# EAGLE design WeMos32Buttons (EAGLE 8.7.0)
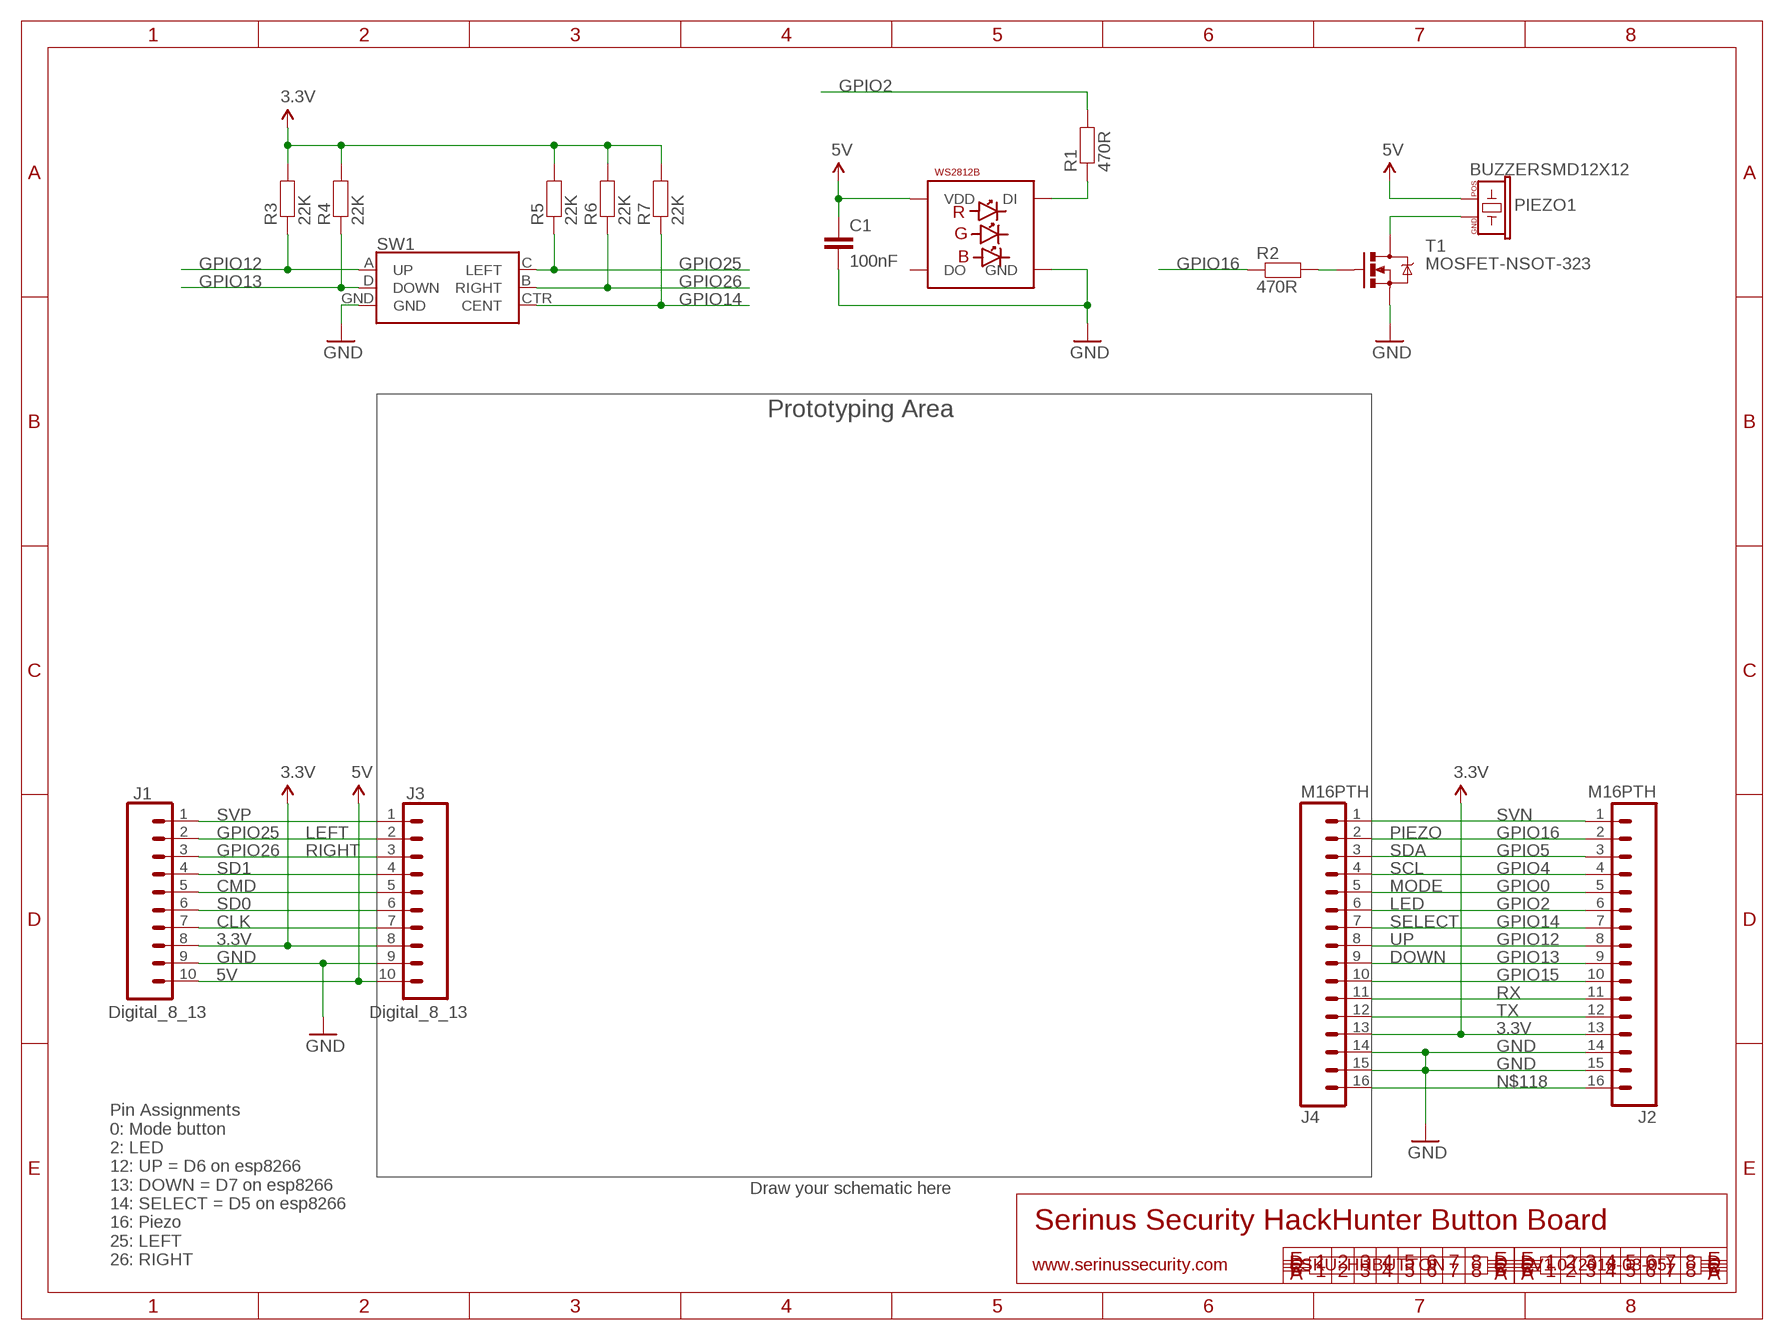
[diagram p0: schematic, sheet 1]

## Parts
C1  100nF  CAP0603  [0603]
J1  Digital_8_13  M100.1  [1X10]
J2  M16PTH  [1X16]
J3  Digital_8_13  M100.1  [1X10]
J4  M16PTH  [1X16]
LED2  WS2812B5050  [WS2812B]
PIEZO1  BUZZERSMD12X12  [BUZZER-12X12-SMT]
R1  470R  RESISTOR0603  [0603]
R2  470R  RESISTOR0603  [0603]
R3  22K  RESISTOR0603  [0603]
R4  22K  RESISTOR0603  [0603]
R5  22K  RESISTOR0603  [0603]
R6  22K  RESISTOR0603  [0603]
R7  22K  RESISTOR0603  [0603]
SW1  JOYSTICK_MINI  [JOYSTICK_MINI]
T1  MOSFET-NSOT-323  [SOT32-3]

## Nets
3.3V: J1.8 J2.13 J3.8 J4.13 R3.2 R4.2 R5.2 R6.2 R7.2
5V: C1.1 J1.10 J3.10 LED2.1-VDD(VDD) PIEZO1.2(POS)
CLK: J1.7 J3.7
CMD: J1.5 J3.5
GND: C1.2 J1.9 J2.14 J2.15 J3.9 J4.14 J4.15 LED2.3-GND(GND) SW1.GND T1.2(S)
GPIO0: J2.5 J4.5
GPIO2: J2.6 J4.6 R1.2
GPIO4: J2.4 J4.4
GPIO5: J2.3 J4.3
GPIO12: J2.8 J4.8 R3.1 SW1.A(UP)
GPIO13: J2.9 J4.9 R4.1 SW1.D(DOWN)
GPIO14: J2.7 J4.7 R7.1 SW1.CTR(CENT)
GPIO15: J2.10 J4.10
GPIO16: J2.2 J4.2 R2.1
GPIO25: J1.2 J3.2 R5.1 SW1.C(LEFT)
GPIO26: J1.3 J3.3 R6.1 SW1.B(RIGHT)
N$8: PIEZO1.1(GND) T1.3(D)
N$9: R2.2 T1.1(G)
N$118: J2.16 J4.16
N$246: LED2.4-DIN(DI) R1.1
RX: J2.11 J4.11
SD0: J1.6 J3.6
SD1: J1.4 J3.4
SVN: J2.1 J4.1
SVP: J1.1 J3.1
TX: J2.12 J4.12
Unconnected: LED2.2-DOUT(DO)

## Notes on the sheet
- Prototyping Area
- LEFT | PIEZO
- RIGHT | SDA
- SCL
- MODE
- LED
- SELECT
- UP
- DOWN
- Draw your schematic here
- Serinus Security HackHunter Button Board
- Pin Assignments
  0: Mode button
  2: LED
  12: UP = D6 on esp8266
  13: DOWN = D7 on esp8266
  14: SELECT = D5 on esp8266
  16: Piezo
  25: LEFT
  26: RIGHT
- www.serinussecurity.com | SKU: HHBUTTON | V1.0 (2018-03-05)

## Library data of the parts
C1 = freetronics-jon:CAP: Capacitor Standard 0603 ceramic capacitor, and 0.1" leaded capacitor.
J1 J3 = freetronics-original:M10: Header 10 Standard 10-pin 0.1" header. Use with straight break away headers (SKU : PRT-00116), right angle break away headers (PRT-00553), swiss pins (PRT-00743), machine pins (PRT-00117), and female headers (PRT-00115).
J2 J4 = freetronics-jon:M16
LED2 = freetronics-jon:WS2812B
PIEZO1 = freetronics-master-v1.1:BUZZER: Buzzer - Piezo Transducer
R1-R7 = freetronics-jon:RESISTOR: Resistor Basic schematic elements and footprints for 0603, 1206, and PTH 1/10th watt (small) resistors.
SW1 = SparkFun-Switches:JOYSTICK_MINI: Small Tactile Joystick w/ Select Switch A 5-way tactile switch allows for a joystick-like interface in a very small package. Part #: 4UCON SF303GJ26 SparkFun Products 5-way Tactile Switch <https://www.sparkfun.com/products/10063> (COM-10063) Used on SparkFun Block for Intel® Edison - OLED <https://www.sparkfun.com/products/13035> (DEV-13035) Used on CAN-BUS Shield <https://www.sparkfun.com/products/13262> (DEV-13262); PROD_ID: SWCH-09905; SF_SKU: COM-10063
T1 = freetronics-jon:MOSFET-N: Basic N-Channel MOSFET

## Board
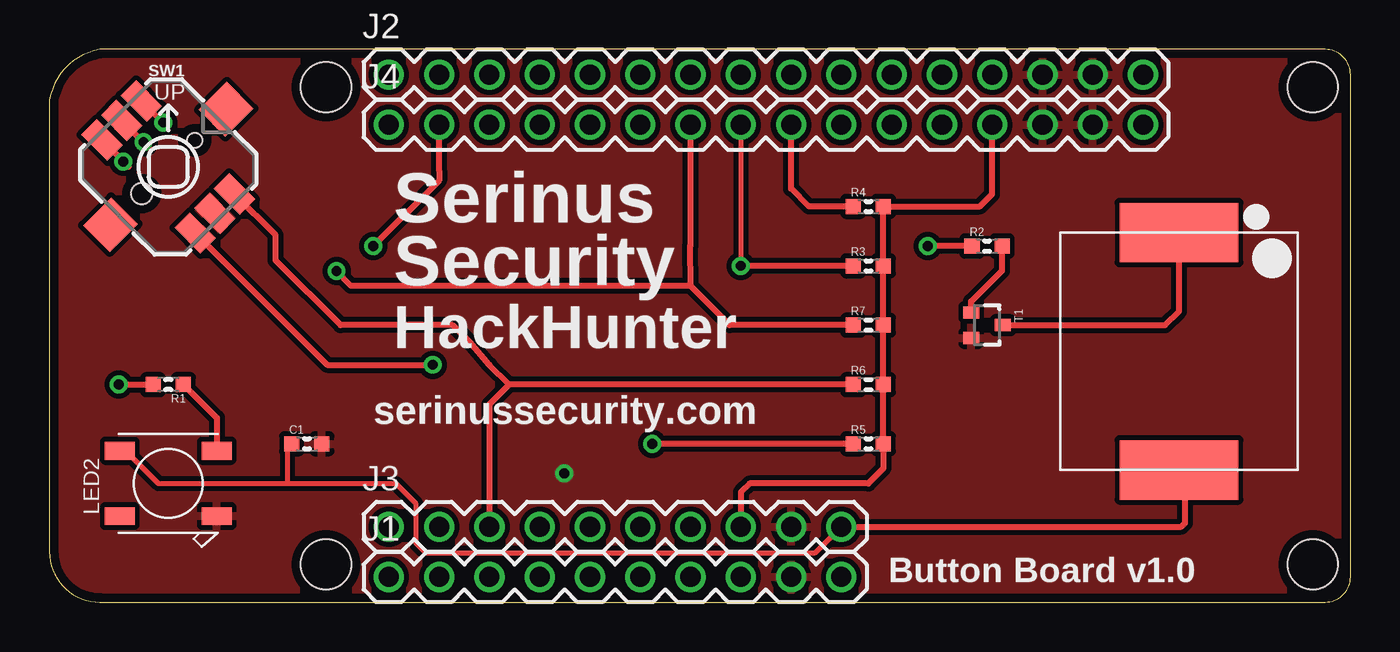
[diagram p1: board, top side]
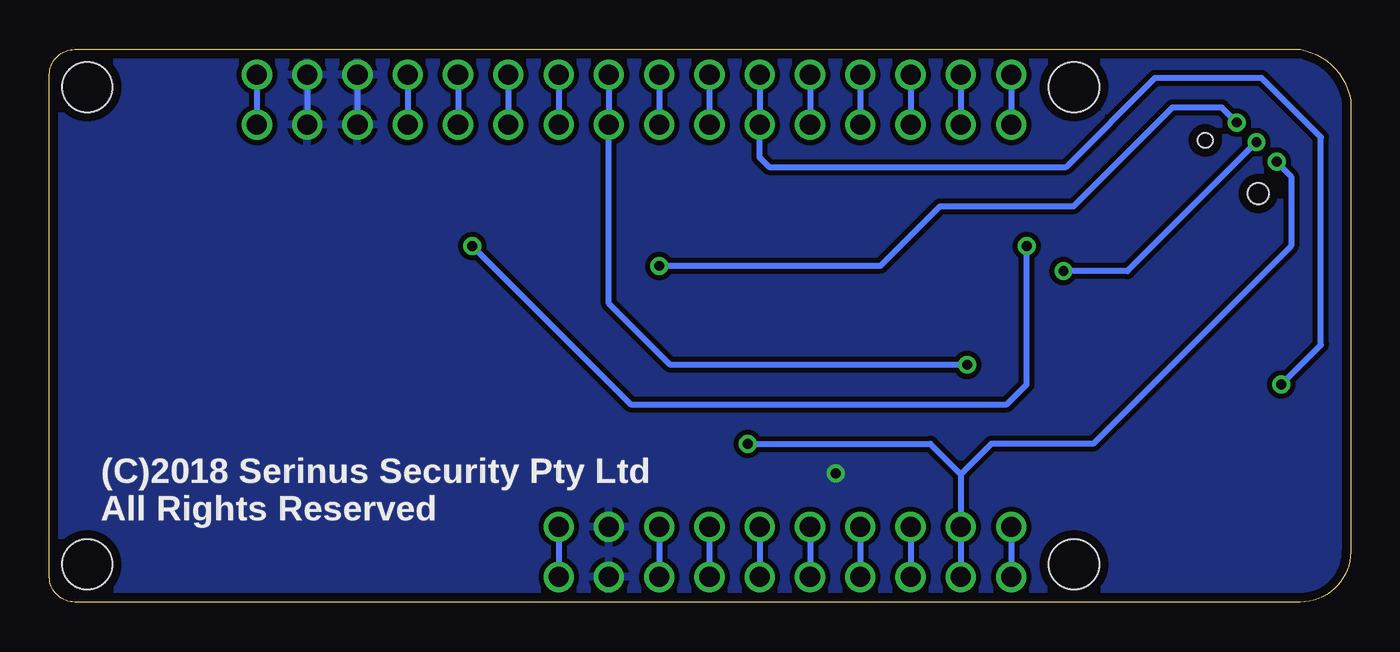
[diagram p2: board, bottom side, seen from below]

Size 65.72 x 27.94 mm. Coordinates in mm from the lower left corner, seen from the top.
Outline: 0,2.54 arc90 2.54,0 64.45,0 arc90 65.72,1.27 65.72,26.67 arc90 64.45,27.94 2.54,27.94 arc70 0,25.4 0,2.54
Copper layers (1*16): Top 0.035mm / dielectric 1.5mm / Bottom 0.035mm
Design rules "default *": minimum track width 10mil, minimum drill 24mil, track to track 10mil, track to pad 10mil, pad to pad 10mil, via to via 10mil, smd to smd 8mil, copper to edge 18mil, drill to drill 8mil, minimum pad ring 10mil, minimum via ring 8mil, stop-mask expansion 4mil, vias tented up to drill 0mil, thermal gap 10mil
Holes 2.54 mm at 13.97,26.04 13.97,1.91 63.82,1.91 63.82,26.04

### Footprints (pad centres in the part's own frame; a part is rotated, then mirrored left to right if it is on the bottom)
0603 = smd 0.762 x 0.762: 1 -0.762,0; 2 0.762,0
1X10 = drill 1.016: 1 0,0; 2 2.54,0; 3 5.08,0; 4 7.62,0; 5 10.16,0; 6 12.7,0; 7 15.24,0; 8 17.78,0; 9 20.32,0; 10 22.86,0
1X16 = drill 1.016: 1 0,0; 2 2.54,0; 3 5.08,0; 4 7.62,0; 5 10.16,0; 6 12.7,0; 7 15.24,0; 8 17.78,0; 9 20.32,0; 10 22.86,0; 11 25.4,0; 12 27.94,0; 13 30.48,0; 14 33.02,0; 15 35.56,0; 16 38.1,0
WS2812B = smd 1.5 x 0.9: 1-VDD 2.45,-1.65; 2-DOUT 2.45,1.65; 3-GND -2.45,1.65; 4-DIN -2.45,-1.65
BUZZER-12X12-SMT = smd 3 x 6: 1 -6,0; 2 6,0
JOYSTICK_MINI = smd 1.85 x 1.1: A -3.325,1.4; B 3.325,1.4; C -3.325,-1.4; CTR -3.325,0; D 3.325,-1.4; GND 3.325,0 | smd 1.9 x 2: NC 0,4.13; NC@0 0,-4.13 | hole 0.75: 0,1.9 | hole 1.05: 0,-1.9
SOT32-3 = smd 0.6 x 0.8: 1 -0.65,-0.8; 2 0.65,-0.8; 3 0,0.8

### Placement (x,y rotation side)
C1  13,8 0 top
J1  17.14,1.27 0 top
J2  17.14,26.67 0 top
J3  17.14,3.81 0 top
J4  17.14,24.13 0 top
LED2  6,6 180 top
PIEZO1  57.06,12.68 270 top
R1  6,11 180 top
R2  47.37,18 0 top
R3  41.37,17 0 top
R4  41.37,20 0 top
R5  41.37,8 0 top
R6  41.37,11 0 top
R7  41.37,14 0 top
SW1  6,22 315 top
T1  47.37,14 270 top

### Tracks (layer width: path | path; a pad name or v marks a point on that pad's centre or on a via)
3.3V
  Top 0.305: J3.8 34.92,5.56 35.37,6 41.37,6 42.13,6.76 R5.2 R6.2 R7.2 R3.2 R4.2 47,20 47.62,20.62 J4.13
  Bottom 0.305: J3.8 J1.8 | J2.13 J4.13
5V
  Top 0.254: LED2.1-VDD 3.85,7.65 5.5,6 12,6 | 12,6 17.5,6 18.5,5 18.5,3 19,2.5 38.7,2.5 J3.10 | C1.1 12,7.76 12,6
  Top 0.305: J3.10 57.17,3.81 57.37,4 57.37,6.98 | 57.37,7 57.37,6.98 | 57.37,6.98 PIEZO1.2
  Bottom 0.305: J3.10 J1.10
CLK
  Bottom 0.305: J3.7 J1.7
CMD
  Bottom 0.305: J3.5 J1.5
GND  (via drill 0.5)
  Bottom 0.305: J2.15 J4.15 | J2.14 J4.14
  other vias: 26,6.5
  pour Bottom: 0,25.4 arc-90 2.54,27.94 64.45,27.94 arc-90 65.72,26.67 65.72,1.27 arc-90 64.45,0 2.54,0 arc-90 0,2.54
  pour Top: 0,25.4 arc-90 2.54,27.94 64.45,27.94 arc-90 65.72,26.67 65.72,1.27 arc-90 64.45,0 2.54,0 arc-90 0,2.54
GPIO0
  Bottom 0.305: J2.5 J4.5
GPIO2  (via drill 0.5)
  Top 0.305: v3.5,11 R1.2
  Bottom 0.305: J2.6 J4.6 29.84,22.48 29.36,22 14.37,22 9.87,26.5 4.5,26.5 1.5,23.5 1.5,13 v3.5,11
GPIO4
  Bottom 0.305: J2.4 J4.4
GPIO5
  Bottom 0.305: J2.3 J4.3
GPIO12  (via drill 0.5)
  Top 0.254: J4.8 v34.92,17
  Top 0.305: R3.1 v34.92,17 | SW1.A 4.66,25.34 v5.75,24.25
  Bottom 0.305: J2.8 J4.8 | v34.92,17 23.75,17 20.75,20 14,20 9,25 6.5,25 v5.75,24.25
GPIO13  (via drill 0.5)
  Top 0.305: R4.1 38.37,20 37.47,20.9 J4.9 | SW1.D 14.02,12 v19.36,12
  Bottom 0.305: J2.9 J4.9 37.47,15.1 34.37,12 v19.36,12
GPIO14  (via drill 0.5)
  Top 0.305: R7.1 34.37,14 32.38,15.98 32.38,16 | 32.38,16 32.37,17.98 | 32.37,17.98 32.37,18 | 32.37,17.98 32.38,18 J4.7 | SW1.CTR 5,23 v4.75,23.25 | v14.5,16.73 15.23,16 32.38,16
  Bottom 0.305: J2.7 J4.7 | v4.75,23.25 11.27,16.73 v14.5,16.73
GPIO15
  Bottom 0.305: J2.10 J4.10
GPIO16  (via drill 0.5)
  Top 0.305: R2.1 v44.37,18 | J4.2 19.68,22 19.68,21.82 19.68,21.32 v16.36,18
  Bottom 0.305: J2.2 J4.2 | v44.37,18 36.37,10 17.36,10 16.36,11 v16.36,18
GPIO25  (via drill 0.5)
  Top 0.305: R5.1 v30.45,8 | SW1.C 4,22.02 4,22 v3.73,22.27
  Bottom 0.305: J1.2 J3.2 19.68,6.46 | v30.45,8 21.23,8 19.68,6.46 | v3.73,22.27 3.73,22.23 3,21.5 3,18 13,8 18.14,8 19.68,6.46
GPIO26
  Top 0.305: R6.1 23.23,11 | 23.23,11 22.23,10 J3.3 | 23.23,11 22.23,12 21.23,13.14 20.36,14 14.71,14 11.43,17.28 11.43,18.55 SW1.B
  Bottom 0.305: J3.3 J1.3
N$8
  Top 0.305: T1.3 56.37,14 57.06,14.7 PIEZO1.1
N$9
  Top 0.305: T1.1 46.56,15.2 48.13,16.76 R2.2
N$118
  Bottom 0.305: J2.16 J4.16
N$246
  Top 0.305: R1.1 8.45,9.31 LED2.4-DIN
RX
  Bottom 0.305: J2.11 J4.11
SD0
  Bottom 0.305: J3.6 J1.6
SD1
  Bottom 0.305: J3.4 J1.4
SVN
  Bottom 0.305: J2.1 J4.1
SVP
  Bottom 0.305: J3.1 J1.1
TX
  Bottom 0.305: J2.12 J4.12

### Text on the board
tPlace: Serinus / Security | HackHunter | serinussecurity.com | Button Board v1.0
bPlace: (C)2018 Serinus Security Pty Ltd / All Rights Reserved